# Altium schematic sheet FLASH.SchDoc
size A4
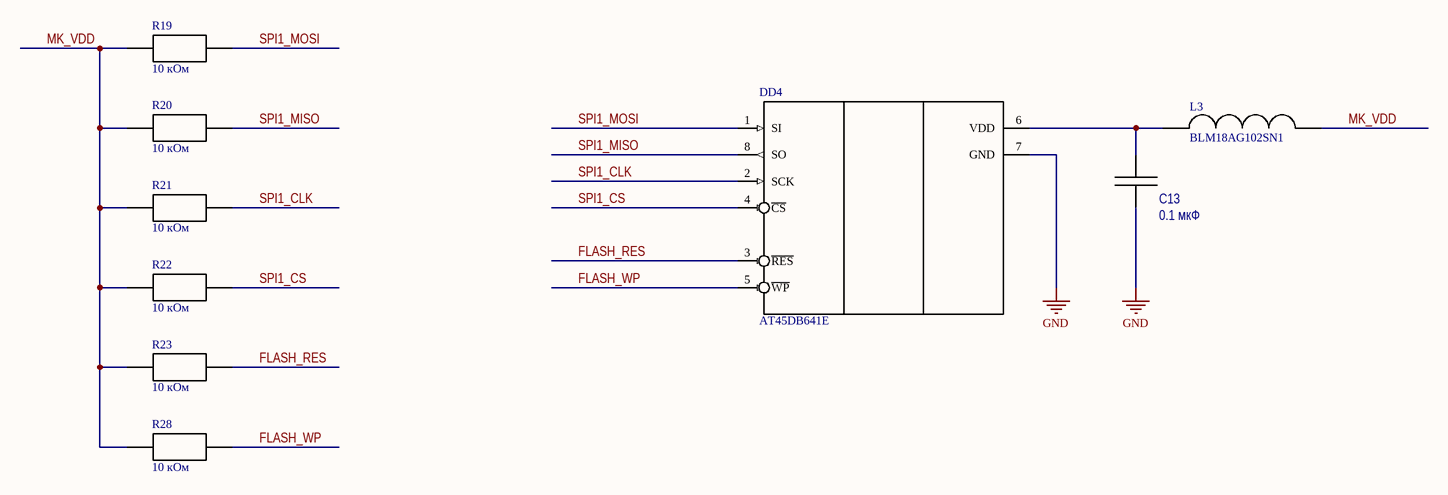
[diagram p0: FLASH.SchDoc]

## Parts
C13  0.1 мкФ  [C 1206]
DD4  AT45DB641E  [SOIC127P800X216-8N]
L3  BLM18AG102SN1  [FB 0603]
R19  10 кОм  [RES 0805]
R20  10 кОм  [RES 0805]
R21  10 кОм  [RES 0805]
R22  10 кОм  [RES 0805]
R23  10 кОм  [RES 0805]
R28  10 кОм  [RES 0805]

## Nets
GND: C13.2 DD4.7(GND)
FLASH_RES: DD4.3(~{RES}) R23.2
FLASH_WP: DD4.5(~{WP}) R28.2
MK_VDD: L3.2 R19.1 R20.1 R21.1 R22.1 R23.1 R28.1
SPI1_CLK: DD4.2(SCK) R21.2
SPI1_CS: DD4.4(~{CS}) R22.2
SPI1_MISO: DD4.8(SO) R20.2
SPI1_MOSI: DD4.1(SI) R19.2
NetC13_1: C13.1 DD4.6(VDD) L3.1

## Library data of the parts
C13 = CAP 1206: SMD Capacitor 1206; Manufacturer: /Укажите компанию-производителя/; Tolerance: /Укажите допуск в процентах/; Temperature coefficient: /Формат: ±? ppm/°C/; Type: Конденсатор керамический; TC: /Укажите тип диэлектрика/; Size: 1206; Temperature range: /Формат: -? ... ? °C/; Value: 0.1 мкФ
R19-R23 R28 = RES 0805